# Altium schematic sheet 13.SchDoc
size 386 x 246 mm
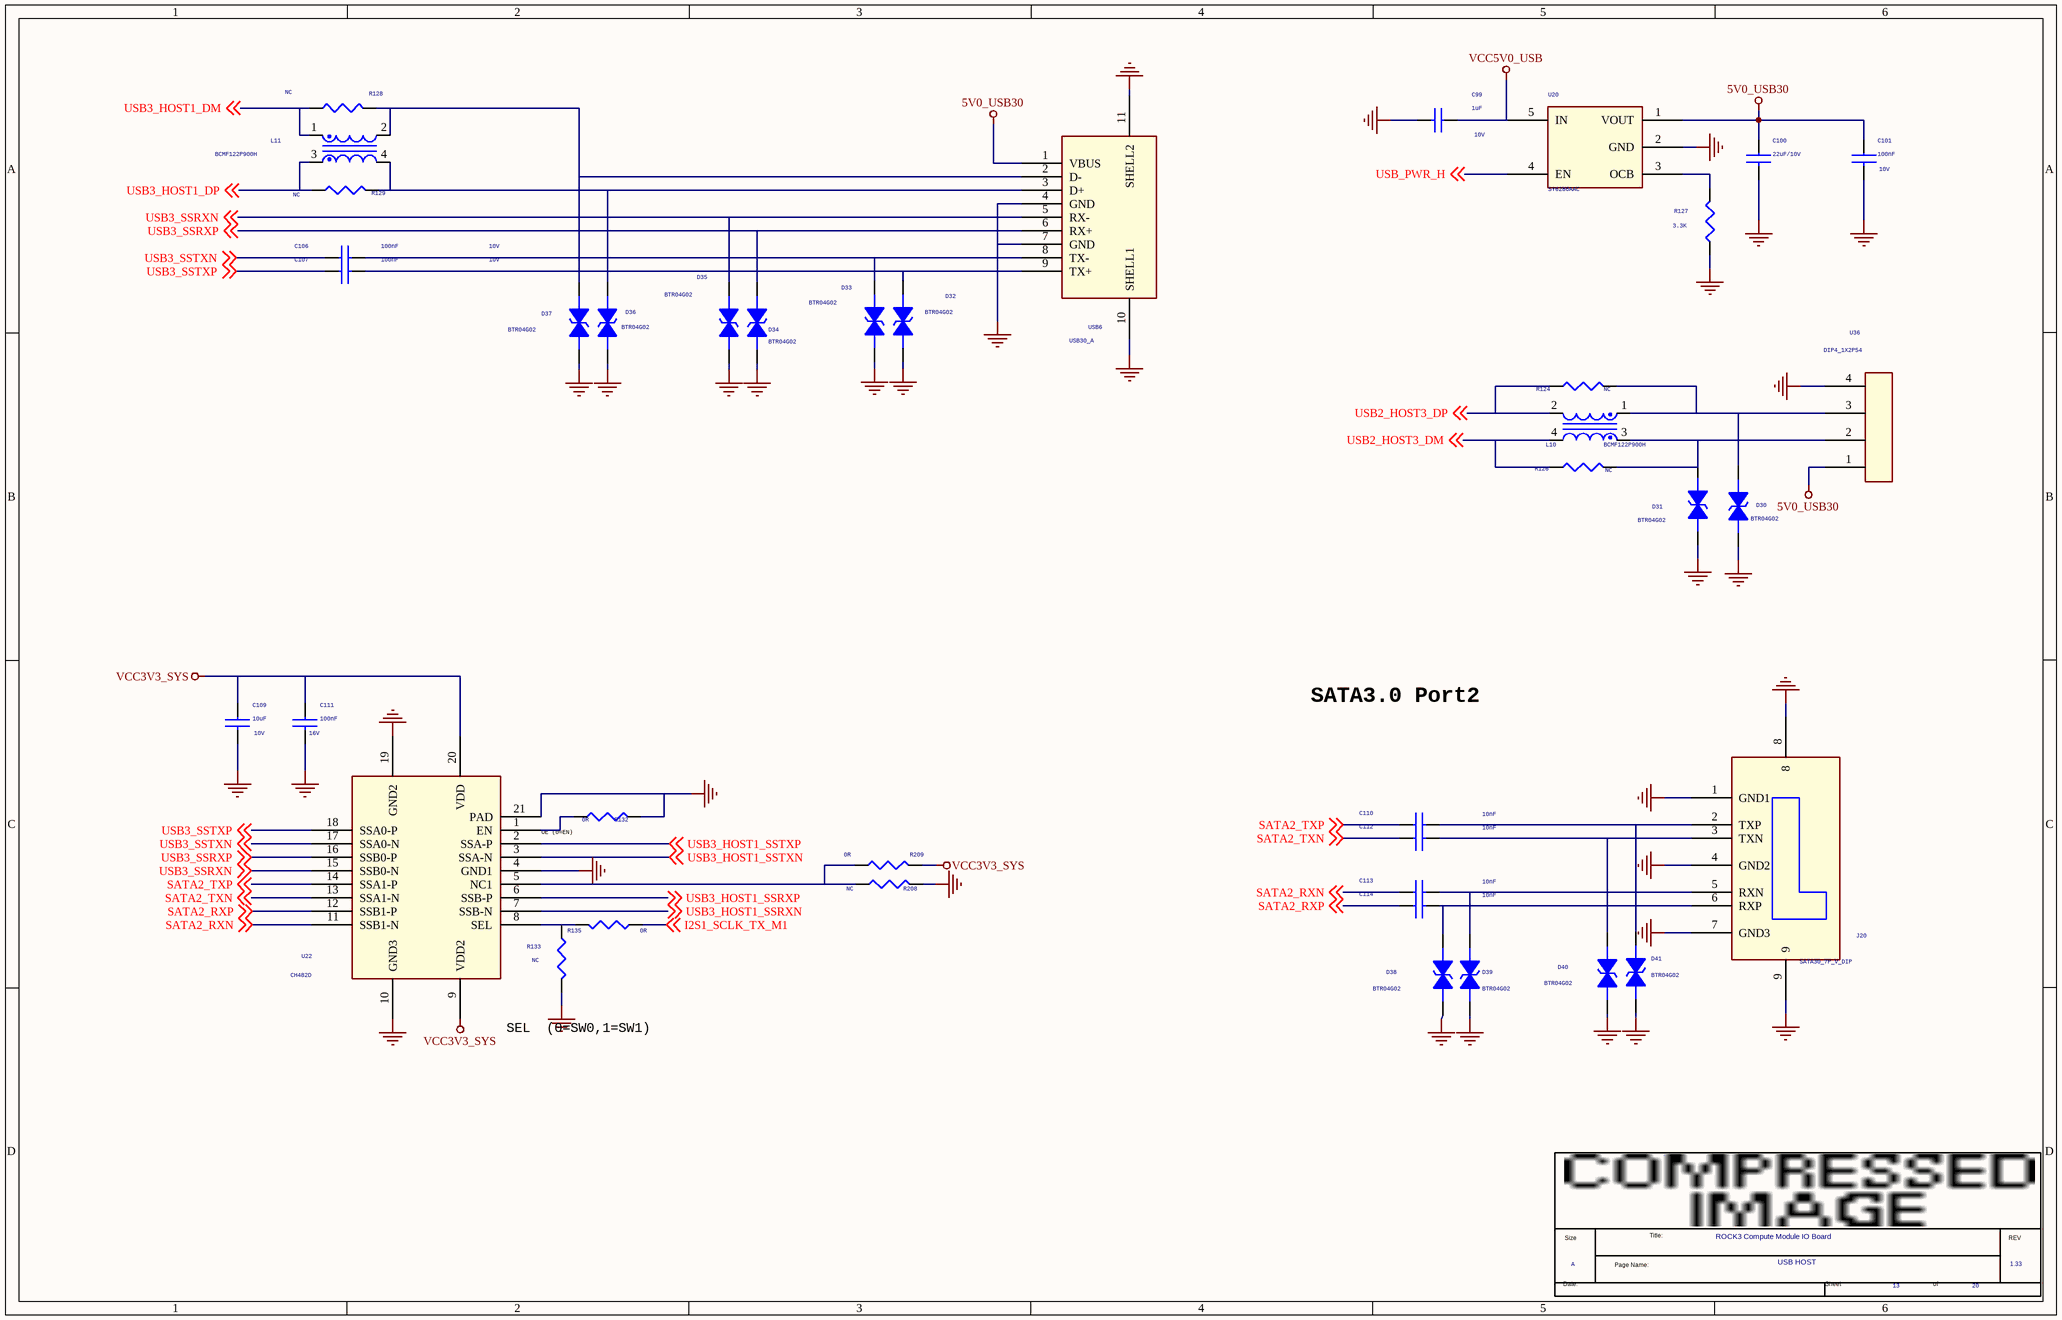
[diagram p0: 13.SchDoc]

## Parts
*  Page Count: 20  Page Number: 13  Page Size: A  Title: ROCK3 Compute Module IO Board  RevCode: 1.33  Doc: USB HOST  (hidden comment: radxa_1010)  (graphical)
C99  1uF  Voltage: 10V  [C0402]
C100  22uF/10V  [C0603]
C101  100nF  Voltage: 10V  [C0402]
C106  100nF  Voltage: 10V  [C0402]
C107  100nF  Voltage: 10V  [C0402]
C109  10uF  Voltage: 10V  [C0603]
C110  10nF  [C0402]
C111  100nF  Voltage: 16V  [C0402]
C112  10nF  [C0402]
C113  10nF  [C0402]
C114  10nF  [C0402]
D30  BTR04G02  [ESD0402_1xD5]
D31  BTR04G02  [ESD0402_1xD5]
D32  BTR04G02  [ESD0402_1xD5]
D33  BTR04G02  [ESD0402_1xD5]
D34  BTR04G02  [ESD0402_1xD5]
D35  BTR04G02  [ESD0402_1xD5]
D36  BTR04G02  [ESD0402_1xD5]
D37  BTR04G02  [ESD0402_1xD5]
D38  BTR04G02  [ESD0402_1xD5]
D39  BTR04G02  [ESD0402_1xD5]
D40  BTR04G02  [ESD0402_1xD5]
D41  BTR04G02  [ESD0402_1xD5]
J20  SATA30_7P_V_DIP  [SMD_SATA_7P_50_180]
L10  BCMF122P900H  [L0402D]
L11  BCMF122P900H  [L0402D]
R124  NC  [R0402]
R126  NC  [R0402]
R127  3.3K  [R0402]
R128  NC  [R0402]
R129  NC  [R0402]
R132  0R  [R0402]
R133  NC  [R0402]
R135  0R  [R0402]
R208  NC  [R0402]
R209  0R  [R0402]
U20  SY6280AAC  [SOT_23_5]
U22  CH482D  [CH482X]
U36  DIP4_1X2P54  [DIP4_1X2P54]
USB6  USB30_A  [USB30]

## Nets
5V0_USB30: C100.1 C101.1 U20.1(VOUT) U36.1 USB6.1(VBUS)
GND: C99.2 C100.2 C101.2 C109.2 C111.2 D30.1 D31.1 D32.1 D33.1 D34.1 D35.1 D36.1 D37.1 D38.1 D39.1 D40.1 D41.1 J20.1(GND1) J20.4(GND2) J20.7(GND3) J20.8 J20.9 R127.2 R132.1 R133.2 R208.1 U20.2(GND) U22.4(GND1) U22.10(GND3) U22.19(GND2) U22.21(PAD) U36.4 USB6.4(GND) USB6.7(GND) USB6.10(SHELL1) USB6.11(SHELL2)
VCC3V3_SYS: C109.1 C111.1 R209.1 U22.9(VDD2) U22.20(VDD)
VCC5V0_USB: C99.1 U20.5(IN)
I2S1_SCLK_TX_M1: R135.2 ; off-sheet I2S1_SCLK_TX_M1
SATA2_RXN: C113.1 U22.11(SSB1-N) ; off-sheet SATA2_RXN
SATA2_RXP: C114.1 U22.12(SSB1-P) ; off-sheet SATA2_RXP
SATA2_TXN: C112.1 U22.13(SSA1-N) ; off-sheet SATA2_TXN
SATA2_TXP: C110.1 U22.14(SSA1-P) ; off-sheet SATA2_TXP
USB2_HOST3_DM: L10.4 R126.1 ; off-sheet USB2_HOST3_DM
USB2_HOST3_DP: L10.2 R124.1 ; off-sheet USB2_HOST3_DP
USB3_HOST1_DM: L11.1 R128.2 ; off-sheet USB3_HOST1_DM
USB3_HOST1_DP: L11.3 R129.2 ; off-sheet USB3_HOST1_DP
USB3_HOST1_SSRXN: U22.7(SSB-N) ; off-sheet USB3_HOST1_SSRXN
USB3_HOST1_SSRXP: U22.6(SSB-P) ; off-sheet USB3_HOST1_SSRXP
USB3_HOST1_SSTXN: U22.3(SSA-N) ; off-sheet USB3_HOST1_SSTXN
USB3_HOST1_SSTXP: U22.2(SSA-P) ; off-sheet USB3_HOST1_SSTXP
USB3_SSRXN: D35.2 U22.15(SSB0-N) USB6.5(RX-) ; off-sheet USB3_SSRXN
USB3_SSRXP: D34.2 U22.16(SSB0-P) USB6.6(RX+) ; off-sheet USB3_SSRXP
USB3_SSTXN: C106.1 U22.17(SSA0-N) ; off-sheet USB3_SSTXN
USB3_SSTXP: C107.1 U22.18(SSA0-P) ; off-sheet USB3_SSTXP
USB_PWR_H: U20.4(EN) ; off-sheet USB_PWR_H
NetC106_2: C106.2 D33.2 USB6.8(TX-)
NetC107_2: C107.2 D32.2 USB6.9(TX+)
NetC110_2: C110.2 D41.2 J20.2(TXP)
NetC112_2: C112.2 D40.2 J20.3(TXN)
NetC113_2: C113.2 D39.2 J20.5(RXN)
NetC114_2: C114.2 D38.2 J20.6(RXP)
NetD30_2: D30.2 L10.1 R124.2 U36.3
NetD31_2: D31.2 L10.3 R126.2 U36.2
NetD36_2: D36.2 L11.4 R129.1 USB6.3(D+)
NetD37_2: D37.2 L11.2 R128.1 USB6.2(D-)
NetR127_1: R127.1 U20.3(OCB)
NetR132_2: R132.2 U22.1(EN)
NetR133_1: R133.1 R135.1 U22.8(SEL)
NetR208_2: R208.2 R209.2 U22.5(NC1)

## Notes on the sheet
- SATA3.0 Port2
- (near R132) OE (0=EN)
- SEL  (0=SW0,1=SW1)
- (in symbol radxa_1010) Size; Title:; REV; Page Name:; Date:; Sheet; of

## Library data of the parts
C99 = CAP NP_0: cap,1.00uF,+/-10%,10V,X5R,C0402; Manufacturer PN: C1005X5R1A105K050BB; Manufacturer: TDK; Tolerance: 10%; C_Voltage: 6.3V; Priority: A; Dielectric: X5R; Created by: JJJ; Part Type: C0402; RK PN: C1005X5R1A105K050BB
C100 = CAP NP_0: cap,100.00nF,+/-10%,10V,X5R,C0402; Manufacturer: TDK; RK PN: C1005X5R1A104K050BA; Priority: A; Tolerance: 10%; Dielectric: X5R; Voltage: 10V; Part Type: C0402; Manufacturer PN: C1005X5R1A104K050BA; Created by: JJJ
C101 = CAP NP_0: cap,100.00nF,+/-10%,10V,X5R,C0402; Manufacturer PN: C1005X5R1A104K050BA; Manufacturer: TDK; Tolerance: 10%; Priority: A; Dielectric: X5R; Created by: JJJ; Part Type: C0402; RK PN: C1005X5R1A104K050BA
C106 = CAP NP_0: cap,100.00nF,+/-10%,10V,X5R,C0201; Manufacturer: TDK; RK PN: C0603X5R1A104K030BC; Priority: A; Tolerance: 10%; Dielectric: X5R; Part Type: C0201; Manufacturer PN: C0603X5R1A104K030BC; Created by: JJJ
C107 = CAP NP_0: cap,100.00nF,+/-10%,10V,X5R,C0201; Manufacturer PN: C0603X5R1A104K030BC; Manufacturer: TDK; Tolerance: 10%; Priority: A; Dielectric: X5R; Created by: JJJ; Part Type: C0201; RK PN: C0603X5R1A104K030BC
C109 = CAP NP_0: cap,22.00uF,+/-10%,10V,X5R,C0805; Manufacturer PN: C2012X5R1A226K125AB; Manufacturer: TDK; Tolerance: 10%; Priority: A; Dielectric: X5R; Created by: JJJ; Part Type: C0805; RK PN: C2012X5R1A226K125AB
C110 C112-C114 = CAP NP_0: cap,10.00nF,+/-10%,10V,X7R,C0201; Manufacturer: TDK; RK PN: C0603X7R1A103K030BA; Priority: A; Tolerance: 10%; Dielectric: X7R; Voltage: 10V; Part Type: C0201; Manufacturer PN: C0603X7R1A103K030BA; Created by: JJJ
C111 = CAP NP_0: cap,100.00nF,+/-10%,16V,X5R,C0402; Manufacturer PN: C1005X5R1C104K050BA; Manufacturer: TDK; Tolerance: 10%; Priority: A; Dielectric: X5R; Created by: JJJ; Part Type: C0402; RK PN: C1005X5R1C104K050BA
D30 D33 D34 D38 D40 D41 = DIODE BI_DIR TRIG_0: 1-Line, Bi-directional, Transient Voltage Suppressors.17.5pF.; Manufacturer: WillSemi(韦尔半导体); RK PN: ESD5451N; Priority: A; OPTION: DNP; Part Type: ESD_TVS; Manufacturer PN: ESD5451N; Created by: JJJ
D31 D32 D35-D37 D39 = DIODE BI_DIR TRIG_0: 1-Line, Bi-directional, Transient Voltage Suppressors.17.5pF.; Manufacturer PN: ESD5451N; Manufacturer: WillSemi(韦尔半导体); OPTION: DNP; Priority: A; Created by: JJJ; Part Type: ESD_TVS; RK PN: ESD5451N
J20 = SATA_DIP_1
L10 L11 = INDUCTOR COM: Winding Type Common Mode Choke Coil; Manufacturer: sunlord; RK PN: SDCW2012-2-900TF; Priority: A; DC Resistor: 0.35ohm; Tolerance: 25%; Irms: 330mA; Resonace frequency: 90R@100M; Part Type: IND; Manufacturer PN: SDCW2012-2-900TF; Created by: JJJ
R124 R132 R208 = RESISTOR_0: 通用厚膜电阻,0R,+/-5%,R0402,1/16W.; Manufacturer: YAGEO; Tolerance: 5%; RK PN: RC0402JR-070RL; Priority: A; Wattage: 1/16W; Part Type: 通用厚膜电阻; Manufacturer PN: RC0402JR-070RL; Created by: YTL
R126 R209 = RESISTOR_0: 通用厚膜电阻,0R,+/-5%,R0402,1/16W.; Manufacturer PN: RC0402JR-070RL; Manufacturer: YAGEO; Tolerance: 5%; Wattage: 1/16W; Priority: A; Created by: YTL; Part Type: 通用厚膜电阻; RK PN: RC0402JR-070RL
R127 = RESISTOR_0: 通用厚膜电阻,4K7,+/-5%,R0402,1/16W.; Manufacturer: YAGEO; Tolerance: 5%; RK PN: RC0402JR-074K7L; Priority: A; Wattage: 1/16W; Part Type: 通用厚膜电阻; Manufacturer PN: RC0402JR-074K7L; Created by: YTL
R128 R129 = RESISTOR_0: 通用厚膜电阻,4K7,+/-1%,R0402,1/16W.; Manufacturer PN: RC0402FR-074K7L; Manufacturer: YAGEO; Tolerance: 1%; Wattage: 1/16W; Priority: A; Created by: YTL; Part Type: 通用厚膜电阻; RK PN: RC0402FR-074K7L
R133 = RESISTOR_0: 通用厚膜电阻,4K7,+/-5%,R0402,1/16W.; Manufacturer PN: RC0402JR-074K7L; Manufacturer: YAGEO; Tolerance: 5%; Wattage: 1/16W; Priority: A; Created by: YTL; Part Type: 通用厚膜电阻; RK PN: RC0402JR-074K7L
R135 = RESISTOR_0: 通用厚膜电阻,100R,+/-5%,R0402,1/16W.; Manufacturer PN: RC0402JR-07100RL; Manufacturer: YAGEO; Tolerance: 5%; Wattage: 1/16W; Priority: A; Created by: YTL; Part Type: 通用厚膜电阻; RK PN: RC0402JR-07100RL
U20 = SWITCH_SY6280: Low Loss Power Distribution Switch; Manufacturer: Silergy（矽力杰）; Priority: A; Created by: JJJ; Manufacturer PN: SY6280AAC; Part Type: Switch; RK PN: SY6280AAC
U22 = CH482X
U36 = CON3_5
USB6 = USB30_TYPE_A: A型USB3.0座，卧式，插焊; Manufacturer: 旺科达; Priority: A; RK PN: USB-HOST_30; Created by: JJJ; Manufacturer Part Number: USB30_A; Part Type: USB Jack
* = radxa_1010: Page Create Date: March  8, 1995